# Altium schematic sheet HYPERRAM.SchDoc
size A4; SheetNumber: 11; SheetTotal: 13
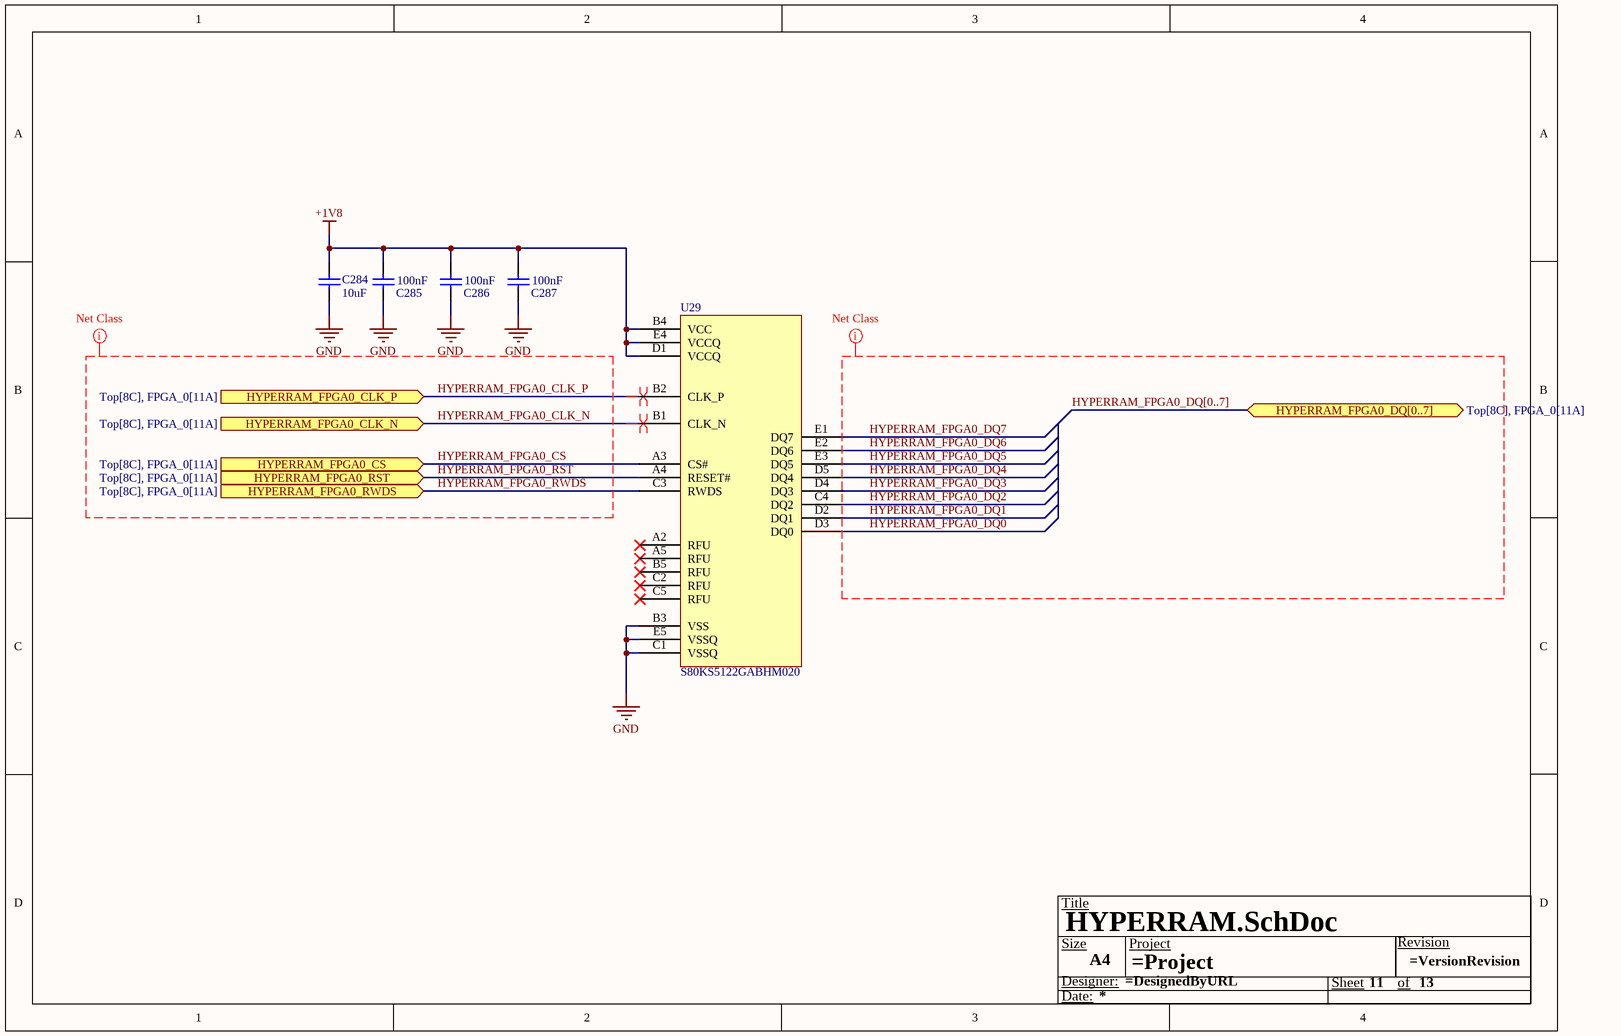
[diagram p0: HYPERRAM.SchDoc]

## Parts
*  Size: A4  (hidden comment: Title Block)  (graphical)
C284  10uF  [CAPC1005X70X10NL05]
C285  100nF  [CAPC1005X05N]
C286  100nF  [CAPC1005X05N]
C287  100nF  [CAPC1005X05N]
U29  S80KS5122GABHM020  [BGA25C100P5X5_800X600X100]

## Ports
HYPERRAM_FPGA0_CLK_N (in, see Top[8C], FPGA_0[11A]), HYPERRAM_FPGA0_CLK_P (in, see Top[8C], FPGA_0[11A]), HYPERRAM_FPGA0_CS (in, see Top[8C], FPGA_0[11A]), HYPERRAM_FPGA0_DQ[0..7] (bidir, see Top[8C], FPGA_0[11A]), HYPERRAM_FPGA0_RST (in, see Top[8C], FPGA_0[11A]), HYPERRAM_FPGA0_RWDS (in, see Top[8C], FPGA_0[11A])

## Nets
+1V8: C284.2 C285.2 C286.2 C287.2 U29.B4(VCC) U29.D1(VCCQ) U29.E4(VCCQ)
GND: C284.1 C285.1 C286.1 C287.1 U29.B3(VSS) U29.C1(VSSQ) U29.E5(VSSQ)
HYPERRAM_FPGA0_CLK_N: U29.B1(CLK_N) ; port HYPERRAM_FPGA0_CLK_N
HYPERRAM_FPGA0_CLK_P: U29.B2(CLK_P) ; port HYPERRAM_FPGA0_CLK_P
HYPERRAM_FPGA0_CS: U29.A3(CS#) ; port HYPERRAM_FPGA0_CS
HYPERRAM_FPGA0_DQ0: U29.D3(DQ0)
HYPERRAM_FPGA0_DQ1: U29.D2(DQ1)
HYPERRAM_FPGA0_DQ2: U29.C4(DQ2)
HYPERRAM_FPGA0_DQ3: U29.D4(DQ3)
HYPERRAM_FPGA0_DQ4: U29.D5(DQ4)
HYPERRAM_FPGA0_DQ5: U29.E3(DQ5)
HYPERRAM_FPGA0_DQ6: U29.E2(DQ6)
HYPERRAM_FPGA0_DQ7: U29.E1(DQ7)
HYPERRAM_FPGA0_RST: U29.A4(RESET#) ; port HYPERRAM_FPGA0_RST
HYPERRAM_FPGA0_RWDS: U29.C3(RWDS) ; port HYPERRAM_FPGA0_RWDS

Not connected (* = marked no-connect by the designer): U29 A2(RFU)* A5(RFU)* B5(RFU)* C2(RFU)* C5(RFU)*

## Buses and harness runs
bus HYPERRAM_FPGA0_DQ[0..7] = port HYPERRAM_FPGA0_DQ[0..7]

## Layout directives
net class PSRAM CMC: HYPERRAM_FPGA0_CLK_N, HYPERRAM_FPGA0_CLK_P, HYPERRAM_FPGA0_CS, HYPERRAM_FPGA0_RST, HYPERRAM_FPGA0_RWDS
net class PSRAM DATA: HYPERRAM_FPGA0_DQ0, HYPERRAM_FPGA0_DQ1, HYPERRAM_FPGA0_DQ2, HYPERRAM_FPGA0_DQ3, HYPERRAM_FPGA0_DQ4, HYPERRAM_FPGA0_DQ5, HYPERRAM_FPGA0_DQ6, HYPERRAM_FPGA0_DQ7, HYPERRAM_FPGA0_DQ[0..7]
differential pair: HYPERRAM_FPGA0_CLK_N, HYPERRAM_FPGA0_CLK_P

## Notes on the sheet
- (in symbol CMP-007-000006-8) Title; Size; Project; Revision; Designer:; Sheet; of; Date:

## Library data of the parts
* = CMP-007-000006-8: Generic Title Block
C284 = CMP-2000-05993-1: Chip Capacitor, 10 uF, +/- 20%, -55 to 85 degC, 0402 (1005 Metric), RoHS, Tape and Reel C1005X5R0J106M050BC; PCN Part Number: MLCCPartNumberChange30/Nov/2012; Manufacturer: TDK; Voltage - Rated: 6.3V; Capacitance: 10µF; Product Training Modules: CSeriesGeneralApplicationsSEAT,CCV,andTVCLDesignToolsGuidetoReplacinganElectrolyticCapacitorwithanMLCC; Online Catalog: CSeries,GeneralPurpose; Kits: 445-9021-KIT-ND-KITMLCC100PF-10UF04026.3-50V445-9003-KIT-ND-KITCAPCERHICAPMLCCSMD; Temperature Coefficient: X5R; Other Names: 445-8920-1; Standard Package: 1; Datasheet URL: http://download.siliconexpert.com/pdfs/2015/4/21/15/54/45/779/tdk_/manual/37024850441143360mlcc_commercial_general_en.pdf; Package Description: 2-Pin Surface Mount Device, Body 1.00 x 0.50 mm; Lead Style: -; RoHS Information: RoHSCertificate-MLCC; Mounting Technology: SurfaceMount; Manufacturer URL: http://www.tdk.com/; Packaging: CutTape(CT); Series: C; Category: Capacitors; Operating Temperature: -55°C~85°C; Ratings: -; Applications: GeneralPurpose; Lead Spacing: -; Family: CeramicCapacitors; Mounting Type: SurfaceMount,MLCC; Package / Case: 0402(1005Metric); Features: -; Thickness (Max): 0.020"(0.50mm); Size / Dimension: 0.039"Lx0.020"W(1.00mmx0.50mm); Datasheet Version: 03/2015; Package Reference: 0402; Tolerance: ±20%; Height - Seated (Max): -
C285-C287 = CMP-001-00095-1: Cap Ceramic 0.1uF 50V X7R 20% SMD 0402 125°C Paper T/R GRM155R71H104ME14J; Voltage: 50V; Capacitance: 100nF; Case: 0402
U29 = CMP-019-00066-3: 512M-bit 200Mhz HYPERRAM